# EAGLE schematic rtkgpio (EAGLE 7.7.0)
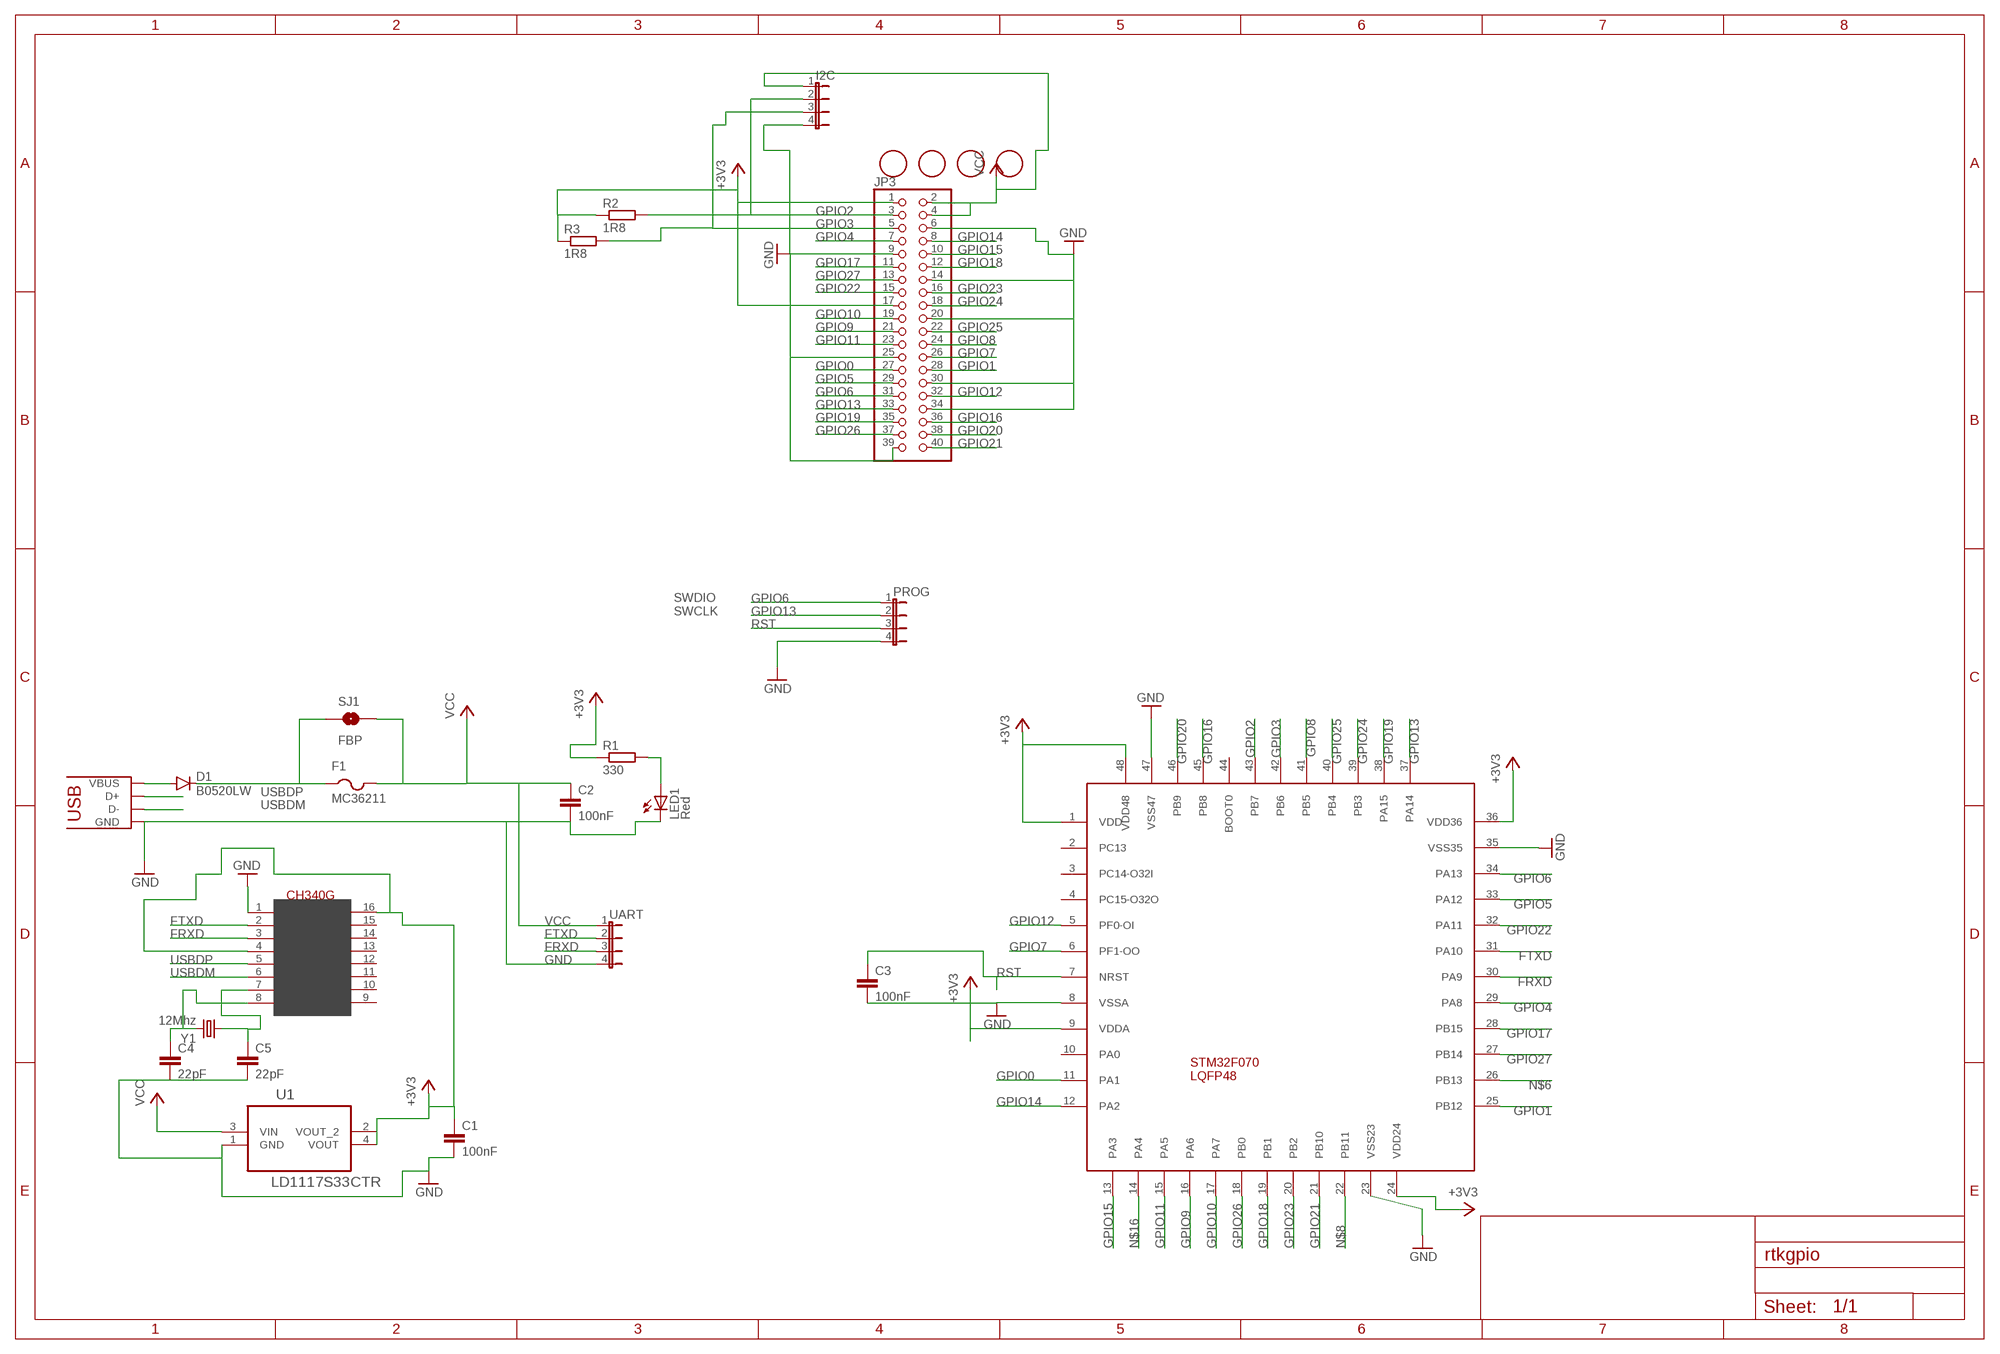
[diagram p0: schematic, sheet 1]

## Parts
C1  100nF  C-EUC0402  [C0402]
C2  100nF  C-EUC0402  [C0402]
C3  100nF  C-EUC0402  [C0402]
C4  22pF  C-EUC0402  [C0402]
C5  22pF  C-EUC0402  [C0402]
D1  B0520LW  DIODESOD123  [SOD-123]
F1  MC36211  PTCFUSE-1206  [R1206]
I2C  JP4E  [JP4]
JP1  USB-MICROB  [USB-MICROB]
JP3  PINHD-2X20  [2X20]
LED1  Red  LEDSML1206  [SML1206]
PROG  JP4E  [JP4]
R1  330  R-EU_R0402  [R0402]
R2  1R8  R-EU_R0402  [R0402]
R3  1R8  R-EU_R0402  [R0402]
SJ1  FBP  SOLDERJUMPERNO  [SJ_2S-NO]
U1  LD1117S33CTR  [SOT230P700X180-4N]
U$1  STM32F0X  STM32F070C6  [LQFP-48]
U$5  FIDUCIAL1MM  [FIDUCIAL-1MM]
U$6  CH340G  [SOIC16]
U$7  FIDUCIAL1MM  [FIDUCIAL-1MM]
U$8  FIDUCIAL1MM  [FIDUCIAL-1MM]
U$9  FIDUCIAL1MM  [FIDUCIAL-1MM]
UART  JP4E  [JP4]
Y1  12Mhz  CRYSTALSM49  [SM49]

## Nets
+3V3: C1.1 JP3.1 JP3.17 R1.1 R2.1 R3.1 U1.2(VOUT_2) U1.4(VOUT) U$1.1(VDD) U$1.9(VDDA) U$1.24(VDD24) U$1.36(VDD36) U$1.48(VDD48) U$6.4(V3) U$6.16(VCC)
FRXD: U$1.30(PA9) U$6.3(RX) UART.3
FTXD: U$1.31(PA10) U$6.2(TX) UART.2
GND: C1.2 C2.2 C3.2 C4.2 C5.2 I2C.4 JP1.GND JP1.MT1(GND) JP1.MT2(GND) JP1.P$1(GND) JP1.P$2(GND) JP1.P$3(GND) JP1.P$4(GND) JP3.6 JP3.9 JP3.14 JP3.20 JP3.25 JP3.30 JP3.34 JP3.39 LED1.C PROG.4 U1.1(GND) U$1.8(VSSA) U$1.23(VSS23) U$1.35(VSS35) U$1.47(VSS47) U$6.1(GND) UART.4
GPIO0: JP3.27 U$1.11(PA1)
GPIO1: JP3.28 U$1.25(PB12)
GPIO2: I2C.2 JP3.3 R2.2 U$1.43(PB7)
GPIO3: I2C.3 JP3.5 R3.2 U$1.42(PB6)
GPIO4: JP3.7 U$1.29(PA8)
GPIO5: JP3.29 U$1.33(PA12)
GPIO6: JP3.31 PROG.1 U$1.34(PA13)
GPIO7: JP3.26 U$1.6(PF1-OO)
GPIO8: JP3.24 U$1.41(PB5)
GPIO9: JP3.21 U$1.16(PA6)
GPIO10: JP3.19 U$1.17(PA7)
GPIO11: JP3.23 U$1.15(PA5)
GPIO12: JP3.32 U$1.5(PF0-OI)
GPIO13: JP3.33 PROG.2 U$1.37(PA14)
GPIO14: JP3.8 U$1.12(PA2)
GPIO15: JP3.10 U$1.13(PA3)
GPIO16: JP3.36 U$1.45(PB8)
GPIO17: JP3.11 U$1.28(PB15)
GPIO18: JP3.12 U$1.19(PB1)
GPIO19: JP3.35 U$1.38(PA15)
GPIO20: JP3.38 U$1.46(PB9)
GPIO21: JP3.40 U$1.21(PB10)
GPIO22: JP3.15 U$1.32(PA11)
GPIO23: JP3.16 U$1.20(PB2)
GPIO24: JP3.18 U$1.39(PB3)
GPIO25: JP3.22 U$1.40(PB4)
GPIO26: JP3.37 U$1.18(PB0)
GPIO27: JP3.13 U$1.27(PB14)
N$1: C5.1 U$6.7(XI) Y1.1
N$4: C4.1 U$6.8(XO) Y1.2
N$5: LED1.A R1.2
N$6: U$1.26(PB13)
N$8: U$1.22(PB11)
N$10: D1.C F1.1 SJ1.1
N$11: D1.A JP1.VBUS
N$16: U$1.14(PA4)
RST: C3.1 PROG.3 U$1.7(NRST)
USBDM: JP1.D- U$6.6(D-)
USBDP: JP1.D+ U$6.5(D+)
VCC: C2.1 F1.2 I2C.1 JP3.2 JP3.4 SJ1.2 U1.3(VIN) UART.1
Unconnected: U$1.2(PC13) U$1.3(PC14-O32I) U$1.4(PC15-O32O) U$1.10(PA0) U$1.44(BOOT0) U$6.9(CTS) U$6.10(DSR) U$6.11(RI) U$6.12(DCD) U$6.13(DTR) U$6.14(RTS) U$6.15(RS232)

## Notes on the sheet
- SWDIO
  SWCLK

## Library data of the parts
C1-C5 = resistor:C-EU: CAPACITOR, European symbol
D1 = SparkFun-DiscreteSemi:DIODE: Diode These are standard reverse protection diodes and small signal diodes. SMA package can handle up to about 1A. SOD-323 can handle about 200mA. What the SOD-323 package when ordering, there are some mfgs out there that are 5-pin packages.
F1 = adafruit:PTCFUSE: PTC fuses, resettable thermistors
I2C PROG UART = jumper:JP4E: JUMPER
JP1 = pimoroni2:USB-MICROB
JP3 = pinhead:PINHD-2X20: PIN HEADER
LED1 = led:LED: LED OSRAM: - CHIPLED LG R971, LG N971, LY N971, LG Q971, LY Q971, LO R971, LY R971 LH N974, LH R974 LS Q976, LO Q976, LY Q976 LO Q996 - Hyper CHIPLED LW Q18S LB Q993, LB Q99A, LB R99A - SideLED LS A670, LO A670, LY A670, LG A670, LP A670 LB A673, LV A673, LT A673, LW A673 LH A674 LY A675 LS A676, LA A676, LO A676, LY A676, LW A676 LS A679, LY A679, LG A679 - Hyper Micro SIDELED® LS Y876, LA Y876, LO Y876, LY Y876 LT Y87S - SmartLED LW L88C, LW L88S LB L89C, LB L89S, LG L890 LS L89K, LO L89K, LY L89K LS L896, LA L896, LO L896, LY L896 - TOPLED LS T670, LO T670, LY T670, LG T670, LP T670 LSG T670, LSP T670, LSY T670, LOP T670, LYG T670 LG T671, LOG T671, LSG T671 LB T673, LV T673, LT T673, LW T673 LH T674 LS T676, LA T676, LO T676, LY T676, LB T676, LH T676, LSB T676, LW T676 LB T67C, LV T67C, LT T67C, LS T67K, LO T67K, LY T67K, LW E67C LS E67B, LA E67B, LO E67B, LY E67B, LB E67C, LV E67C, LT E67C LW T67C LS T679, LY T679, LG T679 LS T770, LO T770, LY T770, LG T770, LP T770 LB T773, LV T773, LT T773, LW T773 LH T774 LS E675, LA E675, LY E675, LS T675 LS T776, LA T776, LO T776, LY T776, LB T776 LHGB T686 LT T68C, LB T68C - Hyper Mini TOPLED® LB M676 - Mini TOPLED Santana® LG M470 LS M47K, LO M47K, LY M47K Source: http://www.osram.convergy.de LUXEON: - LUMILED® LXK2-PW12-R00, LXK2-PW12-S00, LXK2-PW14-U00, LXK2-PW14-V00 LXK2-PM12-R00, LXK2-PM12-S00, LXK2-PM14-U00 LXK2-PE12-Q00, LXK2-PE12-R00, LXK2-PE12-S00, LXK2-PE14-T00, LXK2-PE14-U00 LXK2-PB12-K00, LXK2-PB12-L00, LXK2-PB12-M00, LXK2-PB14-N00, LXK2-PB14-P00, LXK2-PB14-Q00 LXK2-PR12-L00, LXK2-PR12-M00, LXK2-PR14-Q00, LXK2-PR14-R00 LXK2-PD12-Q00, LXK2-PD12-R00, LXK2-PD12-S00 LXK2-PH12-R00, LXK2-PH12-S00 LXK2-PL12-P00, LXK2-PL12-Q00, LXK2-PL12-R00 Source: www.luxeon.com KINGBRIGHT: KA-3528ASYC Source: www.kingbright.com
R1-R3 = resistor:R-EU_: RESISTOR, European symbol
SJ1 = SparkFun-Retired:SOLDERJUMPER: Solder Jumper Standard SMD solder jumper. Used to automate production. Two varients : Normally Open and Normally Closed are the same, but have different paste layers. NC will have a large amount of paste and should jumper during reflow.
U1 = ryanteck:LD1117S33CTR: V REG, 1VDO, 0.8A, 3.3V, 4%, 3SOT223; MPN: LD1117S33CTR; OC_FARNELL: 2253482; OC_NEWARK: 89K0626; PACKAGE: SOT223-3; SUPPLIER: STMicroelectronics
U$1 = ryanteck:STM32F070C6
U$5 U$7-U$9 = pimoroni:FIDUCIAL: 2mm fiducial for pick and place
U$6 = usb-serial:CH340G
Y1 = adafruit:CRYSTAL: CRYSTAL; OC_FARNELL: unknown; OC_NEWARK: unknown